# EAGLE design TestRS485 (EAGLE 5.10)
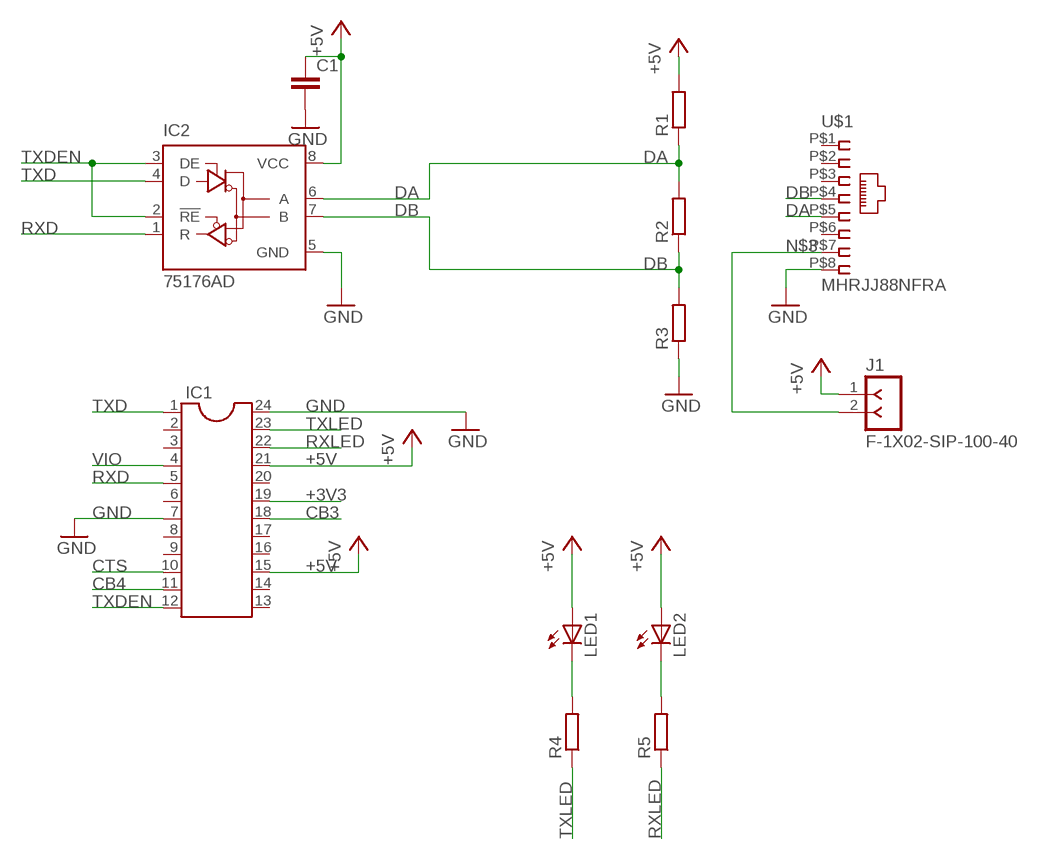
[diagram p0: schematic, sheet 1]

## Parts
C1  C-EU025-025X050  [C025-025X050]
IC1  DIL24-6  [DIL24-6]
IC2  75176AD  [D_R-PDSO-G8]
J1  F-1X02-SIP-100-40  [SIP-100-02-40]
LED1  LEDP-LCC-2  [P-LCC-2]
LED2  LEDP-LCC-2  [P-LCC-2]
R1  R-EU_0207/10  [0207/10]
R2  R-EU_0207/10  [0207/10]
R3  R-EU_0207/10  [0207/10]
R4  R-EU_0207/10  [0207/10]
R5  R-EU_0207/10  [0207/10]
U$1  MHRJJ88NFRA  [MHRJJ8NFRA]

## Nets
+3V3: IC1.19
+5V: C1.1 IC1.15 IC1.21 IC2.8(VCC) J1.1 LED1.A LED2.A R1.2
CB3: IC1.18
CB4: IC1.11
CTS: IC1.10
DA: IC2.6(A) R1.1 R2.2 U$1.P$5
DB: IC2.7(B) R2.1 R3.2 U$1.P$4
GND: C1.2 IC1.7 IC1.24 IC2.5(GND) R3.1 U$1.P$8
N$1: LED1.C R4.2
N$2: LED2.C R5.2
N$3: J1.2 U$1.P$7
RXD: IC1.5 IC2.1(R)
RXLED: IC1.22 R5.1
TXD: IC1.1 IC2.4(D)
TXDEN: IC1.12 IC2.2(!RE) IC2.3(DE)
TXLED: IC1.23 R4.1
VIO: IC1.4
Unconnected: IC1.2 IC1.3 IC1.6 IC1.8 IC1.9 IC1.13 IC1.14 IC1.16 IC1.17 IC1.20 U$1.P$1 U$1.P$2 U$1.P$3 U$1.P$6

## Library data of the parts
C1 = resistor:C-EU: CAPACITOR, European symbol
IC1 = ic-package:DIL24: Dual In Line
IC2 = 751xx:75176A: DIFFERENTIAL BUS TRANSCEIVER Source: http://focus.ti.com/lit/ds/symlink/sn75176a.pdf
J1 = con-headers-jp:F-1X02-: FEMALE HEADER
LED1 LED2 = led:LED: LED OSRAM: - CHIPLED LG R971, LG N971, LY N971, LG Q971, LY Q971, LO R971, LY R971 LH N974, LH R974 LS Q976, LO Q976, LY Q976 LO Q996 - Hyper CHIPLED LW Q18S LB Q993, LB Q99A, LB R99A - SideLED LS A670, LO A670, LY A670, LG A670, LP A670 LB A673, LV A673, LT A673, LW A673 LH A674 LY A675 LS A676, LA A676, LO A676, LY A676, LW A676 LS A679, LY A679, LG A679 - Hyper Micro SIDELED® LS Y876, LA Y876, LO Y876, LY Y876 LT Y87S - SmartLED LW L88C, LW L88S LB L89C, LB L89S, LG L890 LS L89K, LO L89K, LY L89K LS L896, LA L896, LO L896, LY L896 - TOPLED LS T670, LO T670, LY T670, LG T670, LP T670 LSG T670, LSP T670, LSY T670, LOP T670, LYG T670 LG T671, LOG T671, LSG T671 LB T673, LV T673, LT T673, LW T673 LH T674 LS T676, LA T676, LO T676, LY T676, LB T676, LH T676, LSB T676, LW T676 LB T67C, LV T67C, LT T67C, LS T67K, LO T67K, LY T67K, LW E67C LS E67B, LA E67B, LO E67B, LY E67B, LB E67C, LV E67C, LT E67C LW T67C LS T679, LY T679, LG T679 LS T770, LO T770, LY T770, LG T770, LP T770 LB T773, LV T773, LT T773, LW T773 LH T774 LS E675, LA E675, LY E675, LS T675 LS T776, LA T776, LO T776, LY T776, LB T776 LHGB T686 LT T68C, LB T68C - Hyper Mini TOPLED® LB M676 - Mini TOPLED Santana® LG M470 LS M47K, LO M47K, LY M47K Source: http://www.osram.convergy.de LUXEON: - LUMILED® LXK2-PW12-R00, LXK2-PW12-S00, LXK2-PW14-U00, LXK2-PW14-V00 LXK2-PM12-R00, LXK2-PM12-S00, LXK2-PM14-U00 LXK2-PE12-Q00, LXK2-PE12-R00, LXK2-PE12-S00, LXK2-PE14-T00, LXK2-PE14-U00 LXK2-PB12-K00, LXK2-PB12-L00, LXK2-PB12-M00, LXK2-PB14-N00, LXK2-PB14-P00, LXK2-PB14-Q00 LXK2-PR12-L00, LXK2-PR12-M00, LXK2-PR14-Q00, LXK2-PR14-R00 LXK2-PD12-Q00, LXK2-PD12-R00, LXK2-PD12-S00 LXK2-PH12-R00, LXK2-PH12-S00 LXK2-PL12-P00, LXK2-PL12-Q00, LXK2-PL12-R00 Source: www.luxeon.com KINGBRIGHT: KA-3528ASYC Source: www.kingbright.com
R1-R5 = resistor:R-EU_: RESISTOR, European symbol
U$1 = eko-parts:MHRJJ88NFRA: http://onecall.farnell.com/mh-connectors/mhrjj88nfra/socket-rj45-8p8c/dp/3938360

## Board
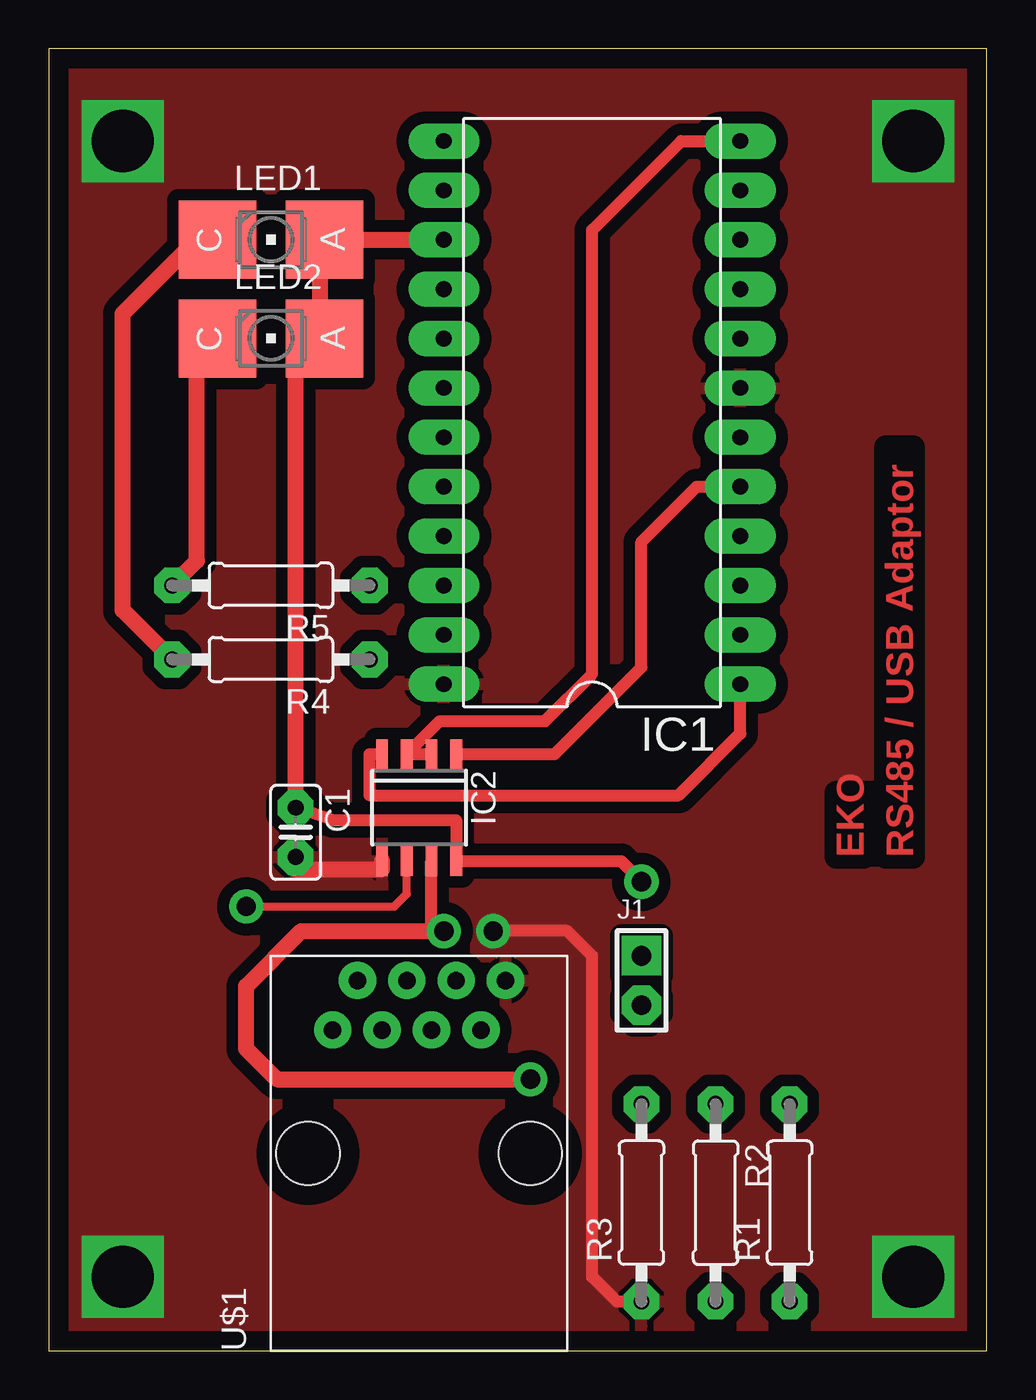
[diagram p1: board, top side]
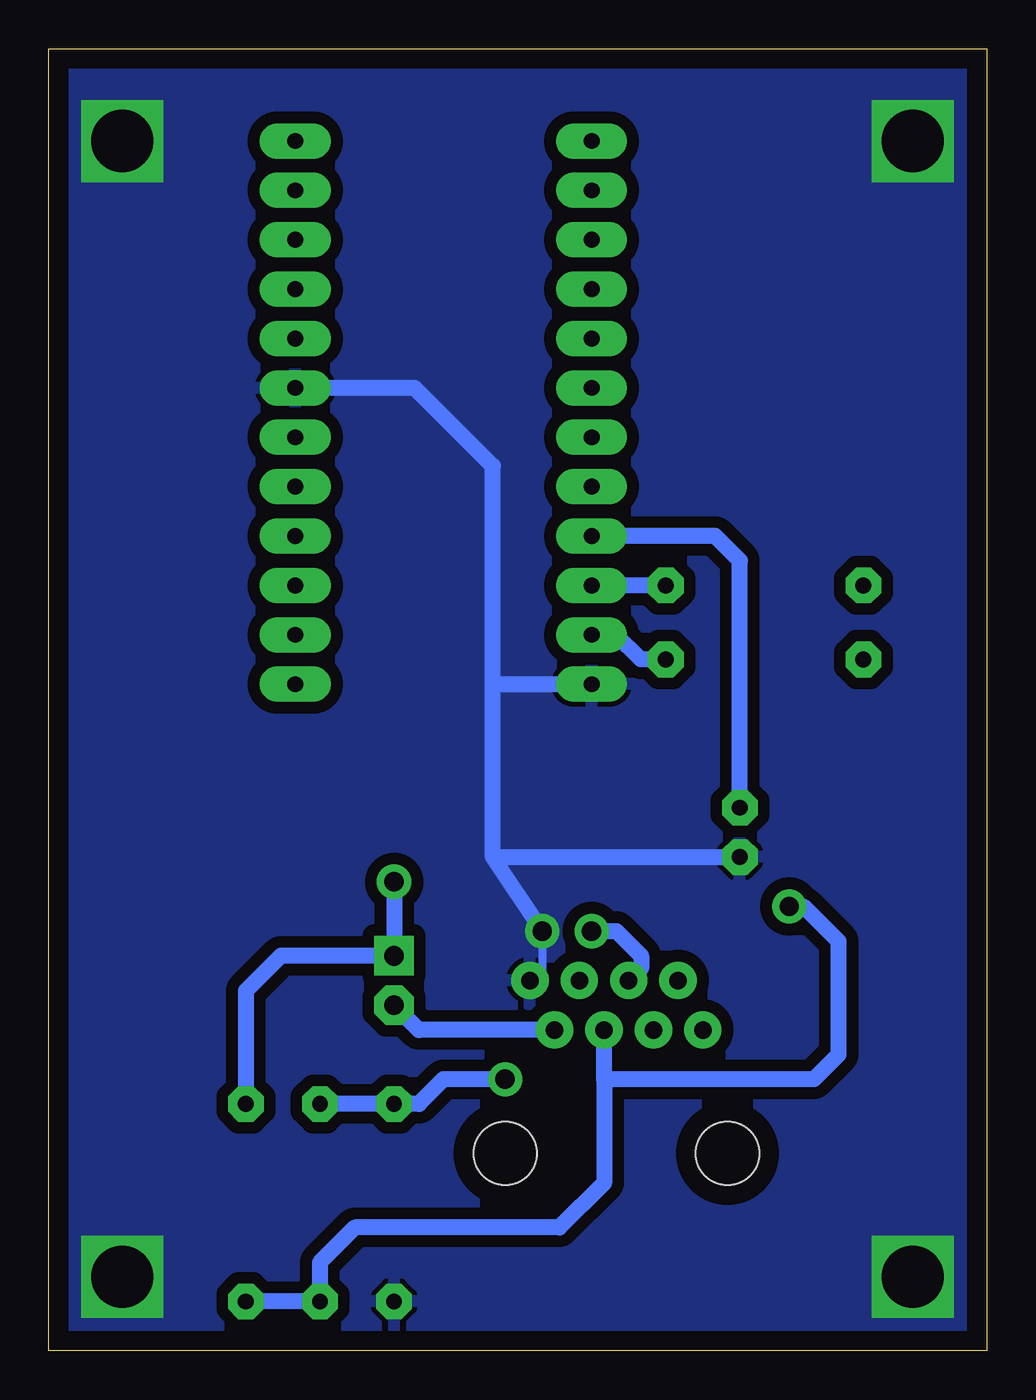
[diagram p2: board, bottom side, seen from below]

Size 48.24 x 66.98 mm. Coordinates in mm from the lower left corner, seen from the top.
Outline: 0,0 48.24,0 48.24,66.98 0,66.98 0,0
Copper layers (1*16): Top 0.035mm / dielectric 1.5mm / Bottom 0.035mm
Design rules "default *": minimum track width 16mil, minimum drill 24mil, track to track 15mil, track to pad 15mil, pad to pad 15mil, via to via 15mil, smd to smd 8mil, copper to edge 40mil, drill to drill 8mil, minimum pad ring 20mil, minimum via ring 15mil, stop-mask expansion 4mil, vias tented up to drill 0mil, thermal gap 10mil

### Footprints (pad centres in the part's own frame; a part is rotated, then mirrored left to right if it is on the bottom)
C025-025X050 = drill 0.813 octagon: 1 -1.27,0; 2 1.27,0
DIL24-6 = drill 0.813 long: 1 -13.97,-7.62; 2 -11.43,-7.62; 3 -8.89,-7.62; 4 -6.35,-7.62; 5 -3.81,-7.62; 6 -1.27,-7.62; 7 1.27,-7.62; 8 3.81,-7.62; 9 6.35,-7.62; 10 8.89,-7.62; 11 11.43,-7.62; 12 13.97,-7.62; 13 13.97,7.62; 14 11.43,7.62; 15 8.89,7.62; 16 6.35,7.62; 17 3.81,7.62; 18 1.27,7.62; 19 -1.27,7.62; 20 -3.81,7.62; 21 -6.35,7.62; 22 -8.89,7.62; 23 -11.43,7.62; 24 -13.97,7.62
D_R-PDSO-G8 = smd 0.6 x 1.5: 1 -1.905,-2.75; 2 -0.635,-2.75; 3 0.635,-2.75; 4 1.905,-2.75; 5 1.905,2.75; 6 0.635,2.75; 7 -0.635,2.75; 8 -1.905,2.75
SIP-100-02-40 = drill 1.016 pad 1.778 square: 1 -1.27,0 | drill 1.016 pad 1.778 octagon: 2 1.27,0
P-LCC-2 = smd 4 x 4: A 0,2.75; C 0,-2.75
0207/10 = drill 0.813 octagon: 1 -5.08,0; 2 5.08,0
MHRJJ8NFRA = drill 0.9 round: P$1 -4.445,6.35; P$2 -3.175,8.89; P$3 -1.905,6.35; P$4 -0.635,8.89; P$5 0.635,6.35; P$6 1.905,8.89; P$7 3.175,6.35; P$8 4.445,8.89 | hole 3.25: -5.715,0; 5.715,0

### Placement (x,y rotation side)
C1  12.7,26.67 270 top
IC1  27.94,48.26 90 top
IC2  19.05,27.94 180 top
J1  30.48,19.05 270 top
LED1  11.43,57.15 270 top
LED2  11.43,52.07 270 top
R1  38.1,7.62 90 top
R2  34.29,7.62 270 top
R3  30.48,7.62 90 top
R4  11.43,35.56 180 top
R5  11.43,39.37 180 top
U$1  19.05,10.16 0 top

### Tracks (layer width: path | path; a pad name or v marks a point on that pad's centre or on a via)
+5V  (via drill 1 pad 1.42)
  Top 0.406: 13.97,57.15 LED1.A | 12.7,50.8 13.97,52.07 LED2.A
  Top 0.61: C1.1 14.61,27.3 20.95,27.3 IC2.8 29.42,25.19 v30.48,24.13
  Top 0.813: LED1.A IC1.15 | 13.97,52.07 13.97,57.15 | C1.1 12.7,50.8
  Bottom 0.813: J1.1 31.75,20.32 | C1.1 12.7,40.64 13.97,41.91 IC1.21 | v30.48,24.13 J1.1 | J1.1 36.3,20.32 38.1,18.52 R1.2
DA  (via drill 1 pad 1.42)
  Top 0.406: v10.16,22.86 17.78,22.86 18.41,23.5 IC2.6
  Bottom 0.813: R1.1 R2.2 34.29,4.55 32.49,6.35 21.97,6.35 19.68,8.64 19.68,13.97 | 19.68,13.97 U$1.P$5 | v10.16,22.86 9.42,22.86 7.62,21.06 7.62,15.24 8.89,13.97 19.68,13.97
DB  (via drill 1 pad 1.42)
  Top 0.61: v20.32,21.59 19.68,21.59 IC2.7
  Top 0.813: v24.77,13.97 11.73,13.97 10.16,15.54 10.16,18.75 13,21.59 v20.32,21.59
  Bottom 0.813: v20.32,21.59 19.05,21.59 17.78,20.32 17.78,19.68 U$1.P$4 | R2.1 R3.2 29.21,12.7 27.94,13.97 v24.77,13.97
GND  (via drill 1 pad 1.42, 3.2, 3.2 pad 3.81)
  Top 0.61: v22.86,21.59 26.67,21.59 27.94,20.32 27.94,3.81 29.21,2.54 R3.1
  Top 0.813: C1.2 12.7,24.77 17.14,24.77 IC2.5
  Bottom 0.406: v22.86,21.59 22.86,19.05
  Bottom 0.813: 25.4,25.4 C1.2 | v22.86,21.59 25.4,25.4 | 25.4,34.29 IC1.24 | 25.4,25.4 25.4,34.29 | 25.4,34.29 25.4,45.51 29.42,49.53 IC1.7
  other vias: 3.81,62.23 44.45,62.23 3.81,3.81 44.45,3.81
  pour Top (isolate 0.61): 0,67.31 48.26,67.31 48.26,0 0,0
  pour Bottom (isolate 0.61): 0,67.31 48.26,67.31 48.26,0 0,0
N$1
  Top 0.406: 7.62,57.15 LED1.C
  Top 0.813: R4.2 3.81,38.1 3.81,53.34 7.62,57.15
N$2
  Top 0.406: 7.62,52.07 LED2.C
  Top 0.813: R5.2 7.62,40.64 7.62,52.07
N$3
  Bottom 0.813: U$1.P$7 29.21,16.51 J1.2
RXD
  Top 0.61: IC2.1 26.01,30.69 30.48,35.16 30.48,41.61 33.32,44.45 IC1.5
RXLED
  Bottom 0.813: R5.1 IC1.22
TXD
  Top 0.61: IC2.4 16.51,30.69 16.51,28.57 32.38,28.57 35.56,31.75 IC1.1
TXDEN
  Top 0.61: IC2.2 IC2.3 20.11,32.38 25.51,32.38 27.94,34.82 27.94,57.65 32.52,62.23 IC1.12
TXLED
  Bottom 0.813: R4.1 17.78,35.56 19.05,36.83 IC1.23

### Text on the board
Top: EKO | RS485 / USB Adaptor